# Altium schematic sheet DDR4 SDRAM.SchDoc
size A3
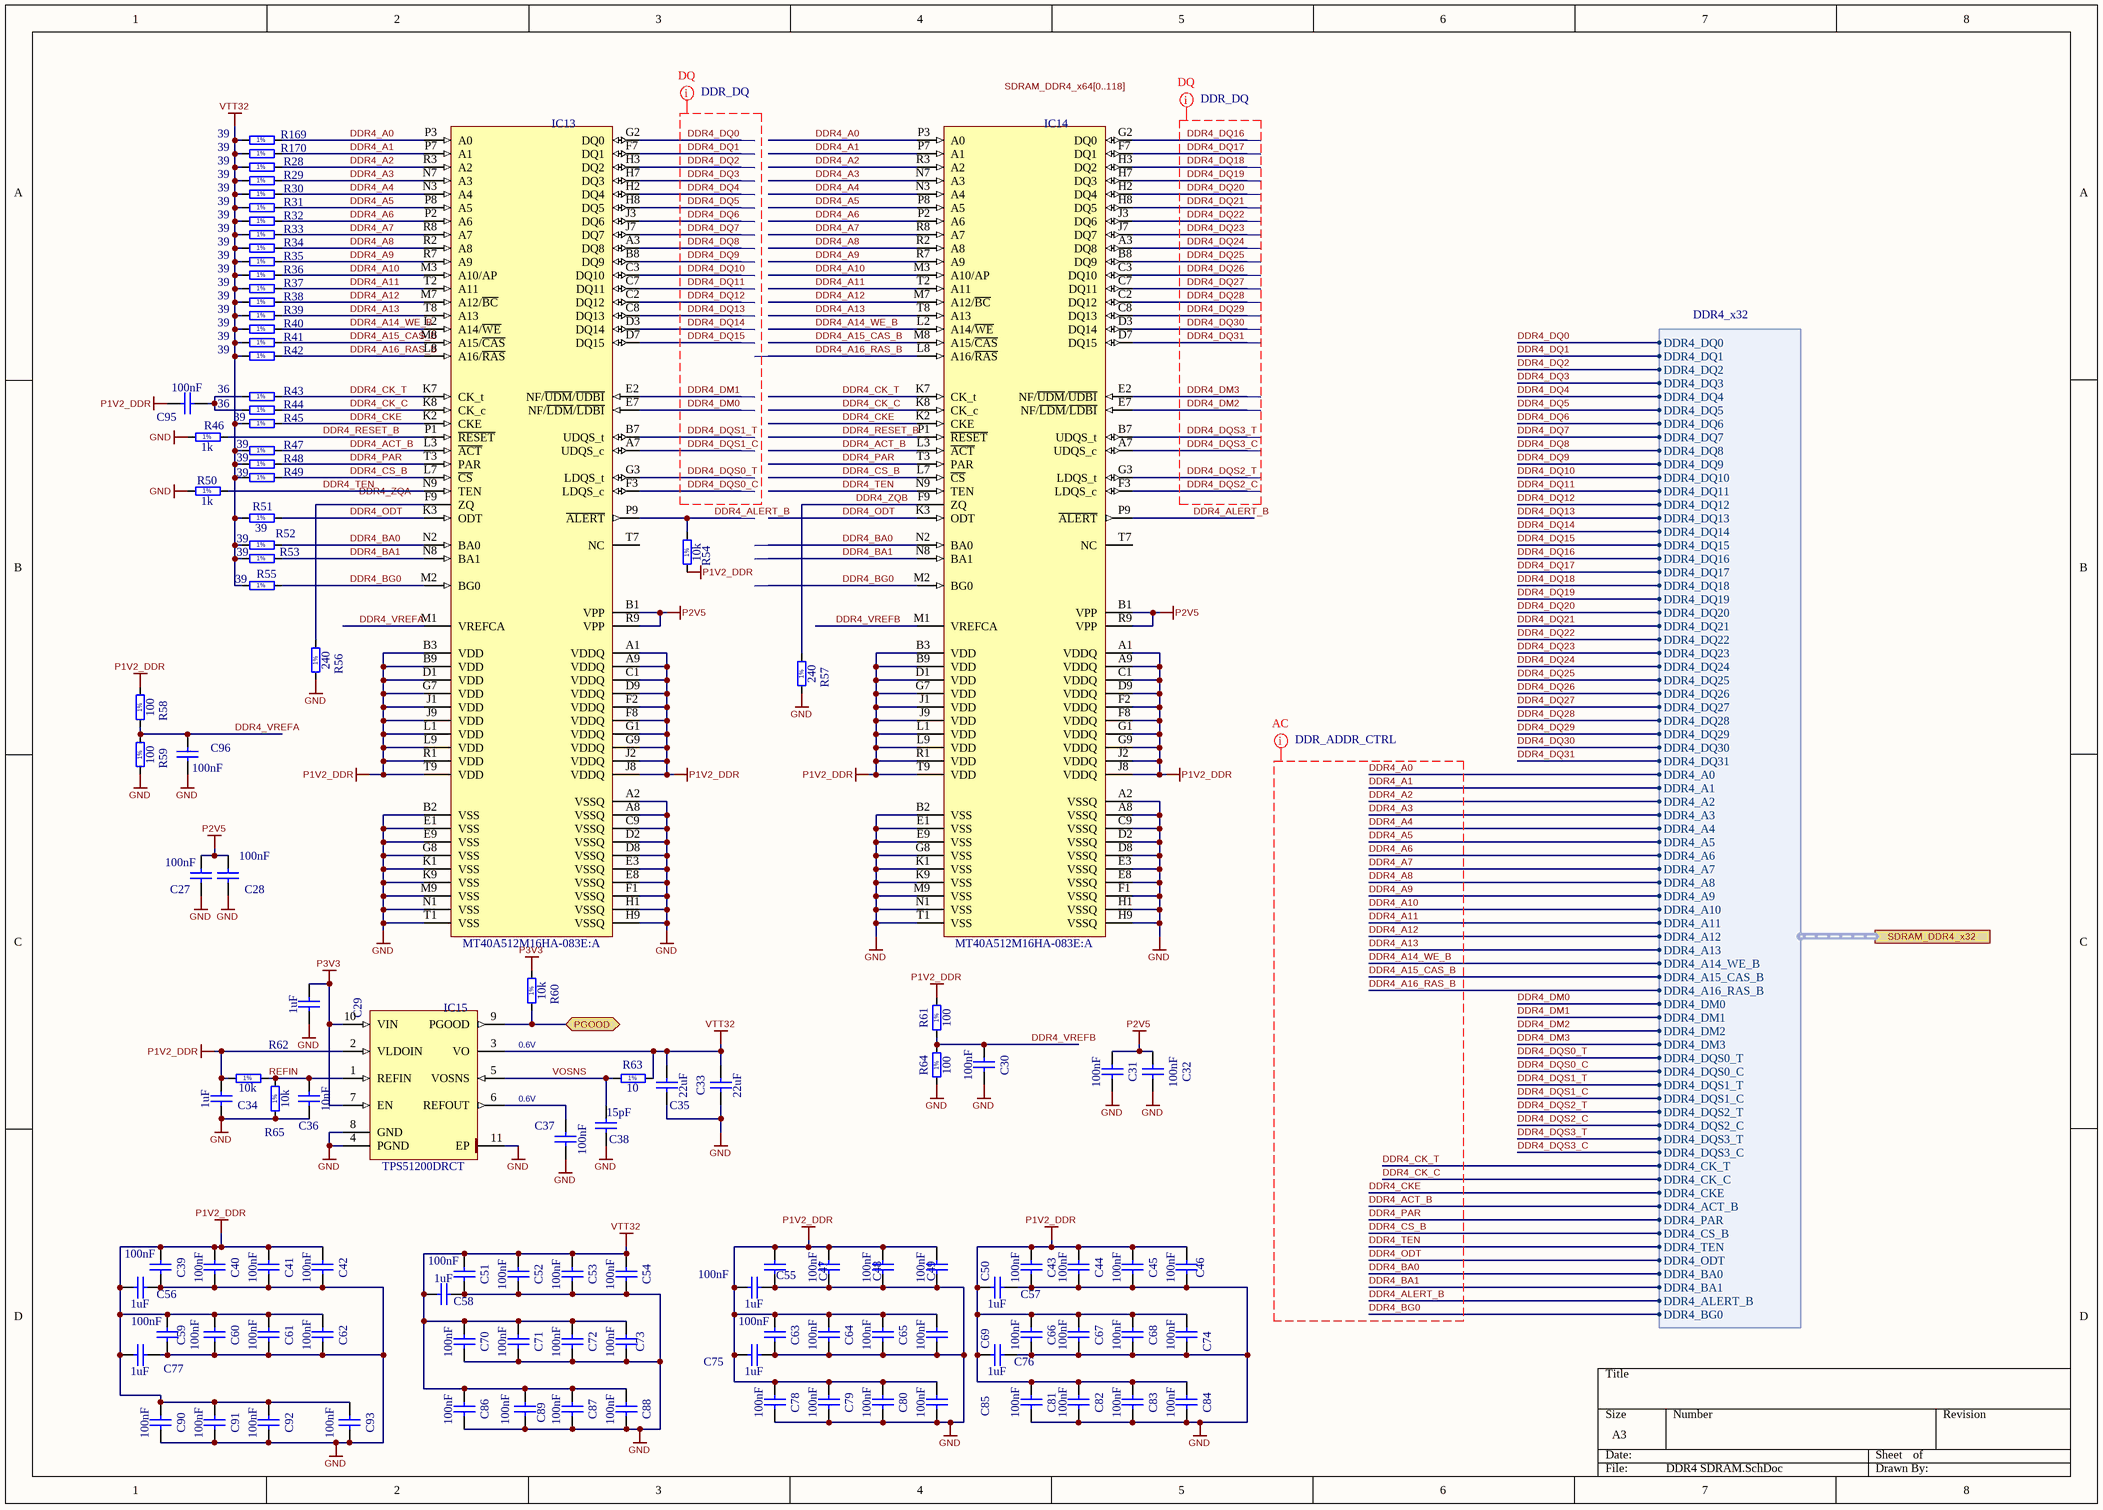
[diagram p0: DDR4 SDRAM.SchDoc]

## Parts
C27  100nF  [CAPC0603X33N]
C28  100nF  [CAPC0603X33N]
C29  1uF  [CAPC1005X55N]
C30  100nF  [CAPC0603X33N]
C31  100nF  [CAPC0603X33N]
C32  100nF  [CAPC0603X33N]
C33  22uF  [CAPC2012X135N]
C34  1uF  [CAPC1005X55N]
C35  22uF  [CAPC2012X135N]
C36  10nF  [CAPC1005X55N]
C37  100nF  [CAPC0603X33N]
C38  15pF  [CAPC1005X55N]
C39  100nF  [CAPC0603X33N]
C40  100nF  [CAPC0603X33N]
C41  100nF  [CAPC0603X33N]
C42  100nF  [CAPC0603X33N]
C43  100nF  [CAPC0603X33N]
C44  100nF  [CAPC0603X33N]
C45  100nF  [CAPC0603X33N]
C46  100nF  [CAPC0603X33N]
C47  100nF  [CAPC0603X33N]
C48  100nF  [CAPC0603X33N]
C49  100nF  [CAPC0603X33N]
C50  100nF  [CAPC0603X33N]
C51  100nF  [CAPC0603X33N]
C52  100nF  [CAPC0603X33N]
C53  100nF  [CAPC0603X33N]
C54  100nF  [CAPC0603X33N]
C55  1uF  [CAPC1005X55N]
C56  1uF  [CAPC1005X55N]
C57  1uF  [CAPC1005X55N]
C58  1uF  [CAPC1005X55N]
C59  100nF  [CAPC0603X33N]
C60  100nF  [CAPC0603X33N]
C61  100nF  [CAPC0603X33N]
C62  100nF  [CAPC0603X33N]
C63  100nF  [CAPC0603X33N]
C64  100nF  [CAPC0603X33N]
C65  100nF  [CAPC0603X33N]
C66  100nF  [CAPC0603X33N]
C67  100nF  [CAPC0603X33N]
C68  100nF  [CAPC0603X33N]
C69  100nF  [CAPC0603X33N]
C70  100nF  [CAPC0603X33N]
C71  100nF  [CAPC0603X33N]
C72  100nF  [CAPC0603X33N]
C73  100nF  [CAPC0603X33N]
C74  100nF  [CAPC0603X33N]
C75  1uF  [CAPC1005X55N]
C76  1uF  [CAPC1005X55N]
C77  1uF  [CAPC1005X55N]
C78  100nF  [CAPC0603X33N]
C79  100nF  [CAPC0603X33N]
C80  100nF  [CAPC0603X33N]
C81  100nF  [CAPC0603X33N]
C82  100nF  [CAPC0603X33N]
C83  100nF  [CAPC0603X33N]
C84  100nF  [CAPC0603X33N]
C85  100nF  [CAPC0603X33N]
C86  100nF  [CAPC0603X33N]
C87  100nF  [CAPC0603X33N]
C88  100nF  [CAPC0603X33N]
C89  100nF  [CAPC0603X33N]
C90  100nF  [CAPC0603X33N]
C91  100nF  [CAPC0603X33N]
C92  100nF  [CAPC0603X33N]
C93  100nF  [CAPC0603X33N]
C95  100nF  [CAPC0603X33N]
C96  100nF  [CAPC0603X33N]
IC13  MT40A512M16HA-083E:A  [BGA96C80P9X16_900X1400X120]
IC14  MT40A512M16HA-083E:A  [BGA96C80P9X16_900X1400X120]
IC15  TPS51200DRCT  [TEXAS_DRC (S-PVSON-N10)]
R28  39  [RESC1005X40N]
R29  39  [RESC1005X40N]
R30  39  [RESC1005X40N]
R31  39  [RESC1005X40N]
R32  39  [RESC1005X40N]
R33  39  [RESC1005X40N]
R34  39  [RESC1005X40N]
R35  39  [RESC1005X40N]
R36  39  [RESC1005X40N]
R37  39  [RESC1005X40N]
R38  39  [RESC1005X40N]
R39  39  [RESC1005X40N]
R40  39  [RESC1005X40N]
R41  39  [RESC1005X40N]
R42  39  [RESC1005X40N]
R43  36  [RESC1005X40N]
R44  36  [RESC1005X40N]
R45  39  [RESC1005X40N]
R46  1k  [RESC1005X40N]
R47  39  [RESC1005X40N]
R48  39  [RESC1005X40N]
R49  39  [RESC1005X40N]
R50  1k  [RESC1005X40N]
R51  39  [RESC1005X40N]
R52  39  [RESC1005X40N]
R53  39  [RESC1005X40N]
R54  10k  [RESC1005X40N]
R55  39  [RESC1005X40N]
R56  240  [RESC1005X40N]
R57  240  [RESC1005X40N]
R58  100  [RESC1005X40N]
R59  100  [RESC1005X40N]
R60  10k  [RESC1005X40N]
R61  100  [RESC1005X40N]
R62  10k  [RESC1005X40N]
R63  10  [RESC1005X40N]
R64  100  [RESC1005X40N]
R65  10k  [RESC1005X40N]
R169  39  [RESC1005X40N]
R170  39  [RESC1005X40N]

## Ports
PGOOD (bidir), SDRAM_DDR4_x32 (harness DDR4_x32)

## Harnesses
DDR4_x32: DDR4_DQ16, DDR4_DQ17, DDR4_DQ18, DDR4_DQ19, DDR4_DQ20, DDR4_DQ21, DDR4_DQ22, DDR4_DQ23, DDR4_DQ24, DDR4_DQ25, DDR4_DQ26, DDR4_DQ27, DDR4_DQ28, DDR4_DQ29, DDR4_DQ30, DDR4_DQ31, DDR4_A0, DDR4_A1, DDR4_A2, DDR4_A3, DDR4_A4, DDR4_A5, DDR4_A6, DDR4_A7, DDR4_A8, DDR4_A9, DDR4_A10, DDR4_A11, DDR4_A12, DDR4_A13, DDR4_A14_WE_B, DDR4_A15_CAS_B, DDR4_A16_RAS_B, DDR4_DM0, DDR4_DM1, DDR4_DM2, DDR4_DM3, DDR4_DQS0_T, DDR4_DQS0_C, DDR4_DQS1_T, DDR4_DQS1_C, DDR4_DQS2_T, DDR4_DQS2_C, DDR4_DQS3_T, DDR4_DQS3_C, DDR4_CK_T, DDR4_CK_C, DDR4_CKE, DDR4_ACT_B, DDR4_PAR, DDR4_CS_B, DDR4_TEN, DDR4_ODT, DDR4_BA0, DDR4_BA1, DDR4_ALERT_B, DDR4_BG0, DDR4_DQ0, DDR4_DQ1, DDR4_DQ2, DDR4_DQ3, DDR4_DQ4, DDR4_DQ5, DDR4_DQ6, DDR4_DQ7, DDR4_DQ8, DDR4_DQ9, DDR4_DQ10, DDR4_DQ11, DDR4_DQ12, DDR4_DQ13, DDR4_DQ14, DDR4_DQ15

## Nets
GND: C27.2 C28.2 C29.2 C30.2 C31.2 C32.2 C33.1 C34.2 C35.1 C36.1 C37.1 C38.1 C39.2 C40.2 C41.2 C42.2 C43.2 C44.2 C45.2 C46.2 C47.2 C48.2 C49.2 C50.2 C51.2 C52.2 C53.2 C54.2 C55.2 C56.2 C57.2 C58.2 C59.2 C60.2 C61.2 C62.2 C63.2 C64.2 C65.2 C66.2 C67.2 C68.2 C69.2 C70.2 C71.2 C72.2 C73.2 C74.2 C75.2 C76.2 C77.2 C78.2 C79.2 C80.2 C81.2 C82.2 C83.2 C84.2 C85.2 C86.2 C87.2 C88.2 C89.2 C90.2 C91.2 C92.2 C93.1 C96.2 IC13.A2(VSSQ) IC13.A8(VSSQ) IC13.B2(VSS) IC13.C9(VSSQ) IC13.D2(VSSQ) IC13.D8(VSSQ) IC13.E1(VSS) IC13.E3(VSSQ) IC13.E8(VSSQ) IC13.E9(VSS) IC13.F1(VSSQ) IC13.G8(VSS) IC13.H1(VSSQ) IC13.H9(VSSQ) IC13.K1(VSS) IC13.K9(VSS) IC13.M9(VSS) IC13.N1(VSS) IC13.T1(VSS) IC14.A2(VSSQ) IC14.A8(VSSQ) IC14.B2(VSS) IC14.C9(VSSQ) IC14.D2(VSSQ) IC14.D8(VSSQ) IC14.E1(VSS) IC14.E3(VSSQ) IC14.E8(VSSQ) IC14.E9(VSS) IC14.F1(VSSQ) IC14.G8(VSS) IC14.H1(VSSQ) IC14.H9(VSSQ) IC14.K1(VSS) IC14.K9(VSS) IC14.M9(VSS) IC14.N1(VSS) IC14.T1(VSS) IC15.4(PGND) IC15.8(GND) IC15.11(EP) R46.1 R50.1 R56.1 R57.1 R59.1 R64.1 R65.1
P1V2_DDR: C34.1 C39.1 C40.1 C41.1 C42.1 C43.1 C44.1 C45.1 C46.1 C47.1 C48.1 C49.1 C50.1 C55.1 C56.1 C57.1 C59.1 C60.1 C61.1 C62.1 C63.1 C64.1 C65.1 C66.1 C67.1 C68.1 C69.1 C74.1 C75.1 C76.1 C77.1 C78.1 C79.1 C80.1 C81.1 C82.1 C83.1 C84.1 C85.1 C90.1 C91.1 C92.1 C93.2 C95.2 IC13.A1(VDDQ) IC13.A9(VDDQ) IC13.B3(VDD) IC13.B9(VDD) IC13.C1(VDDQ) IC13.D1(VDD) IC13.D9(VDDQ) IC13.F2(VDDQ) IC13.F8(VDDQ) IC13.G1(VDDQ) IC13.G7(VDD) IC13.G9(VDDQ) IC13.J1(VDD) IC13.J2(VDDQ) IC13.J8(VDDQ) IC13.J9(VDD) IC13.L1(VDD) IC13.L9(VDD) IC13.R1(VDD) IC13.T9(VDD) IC14.A1(VDDQ) IC14.A9(VDDQ) IC14.B3(VDD) IC14.B9(VDD) IC14.C1(VDDQ) IC14.D1(VDD) IC14.D9(VDDQ) IC14.F2(VDDQ) IC14.F8(VDDQ) IC14.G1(VDDQ) IC14.G7(VDD) IC14.G9(VDDQ) IC14.J1(VDD) IC14.J2(VDDQ) IC14.J8(VDDQ) IC14.J9(VDD) IC14.L1(VDD) IC14.L9(VDD) IC14.R1(VDD) IC14.T9(VDD) IC15.2(VLDOIN) R54.1 R58.2 R61.2 R62.1
P2V5: C27.1 C28.1 C31.1 C32.1 IC13.B1(VPP) IC13.R9(VPP) IC14.B1(VPP) IC14.R9(VPP)
P3V3: C29.1 IC15.7(EN) IC15.10(VIN) R60.2
VTT32: C33.2 C35.2 C51.1 C52.1 C53.1 C54.1 C58.1 C70.1 C71.1 C72.1 C73.1 C86.1 C87.1 C88.1 C89.1 IC15.3(VO) R28.1 R29.1 R30.1 R31.1 R32.1 R33.1 R34.1 R35.1 R36.1 R37.1 R38.1 R39.1 R40.1 R41.1 R42.1 R45.1 R47.1 R48.1 R49.1 R51.1 R52.1 R53.1 R55.1 R63.2 R169.1 R170.1
DDR4_A0: IC13.P3(A0) IC14.P3(A0) R169.2 ; port SDRAM_DDR4_x32.DDR4_A0
DDR4_A1: IC13.P7(A1) IC14.P7(A1) R170.2 ; port SDRAM_DDR4_x32.DDR4_A1
DDR4_A2: IC13.R3(A2) IC14.R3(A2) R28.2 ; port SDRAM_DDR4_x32.DDR4_A2
DDR4_A3: IC13.N7(A3) IC14.N7(A3) R29.2 ; port SDRAM_DDR4_x32.DDR4_A3
DDR4_A4: IC13.N3(A4) IC14.N3(A4) R30.2 ; port SDRAM_DDR4_x32.DDR4_A4
DDR4_A5: IC13.P8(A5) IC14.P8(A5) R31.2 ; port SDRAM_DDR4_x32.DDR4_A5
DDR4_A6: IC13.P2(A6) IC14.P2(A6) R32.2 ; port SDRAM_DDR4_x32.DDR4_A6
DDR4_A7: IC13.R8(A7) IC14.R8(A7) R33.2 ; port SDRAM_DDR4_x32.DDR4_A7
DDR4_A8: IC13.R2(A8) IC14.R2(A8) R34.2 ; port SDRAM_DDR4_x32.DDR4_A8
DDR4_A9: IC13.R7(A9) IC14.R7(A9) R35.2 ; port SDRAM_DDR4_x32.DDR4_A9
DDR4_A10: IC13.M3(A10/AP) IC14.M3(A10/AP) R36.2 ; port SDRAM_DDR4_x32.DDR4_A10
DDR4_A11: IC13.T2(A11) IC14.T2(A11) R37.2 ; port SDRAM_DDR4_x32.DDR4_A11
DDR4_A12: IC13.M7(A12/~{BC}) IC14.M7(A12/~{BC}) R38.2 ; port SDRAM_DDR4_x32.DDR4_A12
DDR4_A13: IC13.T8(A13) IC14.T8(A13) R39.2 ; port SDRAM_DDR4_x32.DDR4_A13
DDR4_A14_WE_B: IC13.L2(A14/~{WE}) IC14.L2(A14/~{WE}) R40.2 ; port SDRAM_DDR4_x32.DDR4_A14_WE_B
DDR4_A15_CAS_B: IC13.M8(A15/~{CAS}) IC14.M8(A15/~{CAS}) R41.2 ; port SDRAM_DDR4_x32.DDR4_A15_CAS_B
DDR4_A16_RAS_B: IC13.L8(A16/~{RAS}) IC14.L8(A16/~{RAS}) R42.2 ; port SDRAM_DDR4_x32.DDR4_A16_RAS_B
DDR4_ACT_B: IC13.L3(~{ACT}) IC14.L3(~{ACT}) R47.2 ; port SDRAM_DDR4_x32.DDR4_ACT_B
DDR4_ALERT_B: IC13.P9(~{ALERT}) IC14.P9(~{ALERT}) R54.2 ; port SDRAM_DDR4_x32.DDR4_ALERT_B
DDR4_BA0: IC13.N2(BA0) IC14.N2(BA0) R52.2 ; port SDRAM_DDR4_x32.DDR4_BA0
DDR4_BA1: IC13.N8(BA1) IC14.N8(BA1) R53.2 ; port SDRAM_DDR4_x32.DDR4_BA1
DDR4_BG0: IC13.M2(BG0) IC14.M2(BG0) R55.2 ; port SDRAM_DDR4_x32.DDR4_BG0
DDR4_CK_C: IC13.K8(CK_c) IC14.K8(CK_c) R44.2 ; port SDRAM_DDR4_x32.DDR4_CK_C
DDR4_CK_T: IC13.K7(CK_t) IC14.K7(CK_t) R43.2 ; port SDRAM_DDR4_x32.DDR4_CK_T
DDR4_CKE: IC13.K2(CKE) IC14.K2(CKE) R45.2 ; port SDRAM_DDR4_x32.DDR4_CKE
DDR4_CS_B: IC13.L7(~{CS}) IC14.L7(~{CS}) R49.2 ; port SDRAM_DDR4_x32.DDR4_CS_B
DDR4_DM0: IC13.E7(NF/~{LDM}/~{LDBI}) ; port SDRAM_DDR4_x32.DDR4_DM0
DDR4_DM1: IC13.E2(NF/~{UDM}/~{UDBI}) ; port SDRAM_DDR4_x32.DDR4_DM1
DDR4_DM2: IC14.E7(NF/~{LDM}/~{LDBI}) ; port SDRAM_DDR4_x32.DDR4_DM2
DDR4_DM3: IC14.E2(NF/~{UDM}/~{UDBI}) ; port SDRAM_DDR4_x32.DDR4_DM3
DDR4_DQ0: IC13.G2(DQ0) ; port SDRAM_DDR4_x32.DDR4_DQ0
DDR4_DQ1: IC13.F7(DQ1) ; port SDRAM_DDR4_x32.DDR4_DQ1
DDR4_DQ2: IC13.H3(DQ2) ; port SDRAM_DDR4_x32.DDR4_DQ2
DDR4_DQ3: IC13.H7(DQ3) ; port SDRAM_DDR4_x32.DDR4_DQ3
DDR4_DQ4: IC13.H2(DQ4) ; port SDRAM_DDR4_x32.DDR4_DQ4
DDR4_DQ5: IC13.H8(DQ5) ; port SDRAM_DDR4_x32.DDR4_DQ5
DDR4_DQ6: IC13.J3(DQ6) ; port SDRAM_DDR4_x32.DDR4_DQ6
DDR4_DQ7: IC13.J7(DQ7) ; port SDRAM_DDR4_x32.DDR4_DQ7
DDR4_DQ8: IC13.A3(DQ8) ; port SDRAM_DDR4_x32.DDR4_DQ8
DDR4_DQ9: IC13.B8(DQ9) ; port SDRAM_DDR4_x32.DDR4_DQ9
DDR4_DQ10: IC13.C3(DQ10) ; port SDRAM_DDR4_x32.DDR4_DQ10
DDR4_DQ11: IC13.C7(DQ11) ; port SDRAM_DDR4_x32.DDR4_DQ11
DDR4_DQ12: IC13.C2(DQ12) ; port SDRAM_DDR4_x32.DDR4_DQ12
DDR4_DQ13: IC13.C8(DQ13) ; port SDRAM_DDR4_x32.DDR4_DQ13
DDR4_DQ14: IC13.D3(DQ14) ; port SDRAM_DDR4_x32.DDR4_DQ14
DDR4_DQ15: IC13.D7(DQ15) ; port SDRAM_DDR4_x32.DDR4_DQ15
DDR4_DQ16: IC14.G2(DQ0) ; port SDRAM_DDR4_x32.DDR4_DQ16
DDR4_DQ17: IC14.F7(DQ1) ; port SDRAM_DDR4_x32.DDR4_DQ17
DDR4_DQ18: IC14.H3(DQ2) ; port SDRAM_DDR4_x32.DDR4_DQ18
DDR4_DQ19: IC14.H7(DQ3) ; port SDRAM_DDR4_x32.DDR4_DQ19
DDR4_DQ20: IC14.H2(DQ4) ; port SDRAM_DDR4_x32.DDR4_DQ20
DDR4_DQ21: IC14.H8(DQ5) ; port SDRAM_DDR4_x32.DDR4_DQ21
DDR4_DQ22: IC14.J3(DQ6) ; port SDRAM_DDR4_x32.DDR4_DQ22
DDR4_DQ23: IC14.J7(DQ7) ; port SDRAM_DDR4_x32.DDR4_DQ23
DDR4_DQ24: IC14.A3(DQ8) ; port SDRAM_DDR4_x32.DDR4_DQ24
DDR4_DQ25: IC14.B8(DQ9) ; port SDRAM_DDR4_x32.DDR4_DQ25
DDR4_DQ26: IC14.C3(DQ10) ; port SDRAM_DDR4_x32.DDR4_DQ26
DDR4_DQ27: IC14.C7(DQ11) ; port SDRAM_DDR4_x32.DDR4_DQ27
DDR4_DQ28: IC14.C2(DQ12) ; port SDRAM_DDR4_x32.DDR4_DQ28
DDR4_DQ29: IC14.C8(DQ13) ; port SDRAM_DDR4_x32.DDR4_DQ29
DDR4_DQ30: IC14.D3(DQ14) ; port SDRAM_DDR4_x32.DDR4_DQ30
DDR4_DQ31: IC14.D7(DQ15) ; port SDRAM_DDR4_x32.DDR4_DQ31
DDR4_DQS0_C: IC13.F3(LDQS_c) ; port SDRAM_DDR4_x32.DDR4_DQS0_C
DDR4_DQS0_T: IC13.G3(LDQS_t) ; port SDRAM_DDR4_x32.DDR4_DQS0_T
DDR4_DQS1_C: IC13.A7(UDQS_c) ; port SDRAM_DDR4_x32.DDR4_DQS1_C
DDR4_DQS1_T: IC13.B7(UDQS_t) ; port SDRAM_DDR4_x32.DDR4_DQS1_T
DDR4_DQS2_C: IC14.F3(LDQS_c) ; port SDRAM_DDR4_x32.DDR4_DQS2_C
DDR4_DQS2_T: IC14.G3(LDQS_t) ; port SDRAM_DDR4_x32.DDR4_DQS2_T
DDR4_DQS3_C: IC14.A7(UDQS_c) ; port SDRAM_DDR4_x32.DDR4_DQS3_C
DDR4_DQS3_T: IC14.B7(UDQS_t) ; port SDRAM_DDR4_x32.DDR4_DQS3_T
DDR4_ODT: IC13.K3(ODT) IC14.K3(ODT) R51.2 ; port SDRAM_DDR4_x32.DDR4_ODT
DDR4_PAR: IC13.T3(PAR) IC14.T3(PAR) R48.2 ; port SDRAM_DDR4_x32.DDR4_PAR
DDR4_RESET_B: IC13.P1(~{RESET}) IC14.P1(~{RESET}) R46.2
DDR4_TEN: IC13.N9(TEN) IC14.N9(TEN) R50.2 ; port SDRAM_DDR4_x32.DDR4_TEN
DDR4_VREFA: C96.1 IC13.M1(VREFCA) R58.1 R59.2
DDR4_VREFB: C30.1 IC14.M1(VREFCA) R61.1 R64.2
DDR4_ZQB: IC14.F9(ZQ) R57.2
PGOOD: IC15.9(PGOOD) R60.1 ; port PGOOD
REFIN: C36.2 IC15.1(REFIN) R62.2 R65.2
VOSNS: C38.2 IC15.5(VOSNS) R63.1
NetC37_2: C37.2 IC15.6(REFOUT)
NetC95_1: C95.1 R43.1 R44.1
NetIC13_F9: IC13.F9(ZQ) R56.2

Not connected (* = marked no-connect by the designer): IC13 T7(NC); IC14 T7(NC)

## Buses and harness runs
bus SDRAM_DDR4_x64[0..118]

## Layout directives
net class DDR_DQ: DDR4_DM0, DDR4_DM1, DDR4_DM2, DDR4_DM3, DDR4_DQ0, DDR4_DQ1, DDR4_DQ2, DDR4_DQ3, DDR4_DQ4, DDR4_DQ5, DDR4_DQ6, DDR4_DQ7, DDR4_DQ8, DDR4_DQ9, DDR4_DQ10, DDR4_DQ11, DDR4_DQ12, DDR4_DQ13, DDR4_DQ14, DDR4_DQ15, DDR4_DQ16, DDR4_DQ17, DDR4_DQ18, DDR4_DQ19, DDR4_DQ20, DDR4_DQ21, DDR4_DQ22, DDR4_DQ23, DDR4_DQ24, DDR4_DQ25, DDR4_DQ26, DDR4_DQ27, DDR4_DQ28, DDR4_DQ29, DDR4_DQ30, DDR4_DQ31, DDR4_DQS0_C, DDR4_DQS0_T, DDR4_DQS1_C, DDR4_DQS1_T, DDR4_DQS2_C, DDR4_DQS2_T, DDR4_DQS3_C, DDR4_DQS3_T
net class DDR_ADDR_CTRL: DDR4_A0, DDR4_A1, DDR4_A2, DDR4_A3, DDR4_A4, DDR4_A5, DDR4_A6, DDR4_A7, DDR4_A8, DDR4_A9, DDR4_A10, DDR4_A11, DDR4_A12, DDR4_A13, DDR4_A14_WE_B, DDR4_A15_CAS_B, DDR4_A16_RAS_B, DDR4_ACT_B, DDR4_ALERT_B, DDR4_BA0, DDR4_BA1, DDR4_BG0, DDR4_CK_C, DDR4_CK_T, DDR4_CKE, DDR4_CS_B, DDR4_ODT, DDR4_PAR, DDR4_TEN

## Notes on the sheet
- 0.6V
- Labels drawn without touching a wire or pin: DDR4_ZQA, SDRAM_DDR4_x64[0..118]
- (in symbol R0402_1K_1%_0.0625W_100PPM) 1%
- (in symbol R0402_10K_1%_0.0625W_100PPM) 1%
- (in symbol R0402_10R_1%_0.0625W_200PPM) 1%
- (in symbol R0402_36R_1%_0.0625W_100PPM) 1%
- (in symbol R0402_39R_1%_0.0625W_100PPM) 1%
- (in symbol R0402_100R_1%_0.0625W_100PPM) 1%
- (in symbol R0402_240R_1%_0.0625W_100PPM) 1%

## Library data of the parts
C27 C28 C30-C32 C37 C39-C54 C59-C74 C78-C93 C95 C96 = CC0201_100NF_6.3V_10%_X5R: Non-polarised capacitor; Manufacturer: GENERIC; Part Description: SMD Multilayer Chip Ceramic Capacitor; Manufacturer1 Part Number: 02016D104KAT2A; Tolerance: ±10%; Voltage: 6.3V; TC: X5R; Manufacturer Part Number: CC0201_100NF_6.3V_10%_X5R; Part Number: CC0201_100NF_6.3V_10%_X5R; Value: 100nF; Component Kind: Standard; Component Type: Standard; Pin Count: 2; Status: Not Recommended; Case: 0201; Mounted: Yes; Socket: No; SMD: Yes; Sense: No; Manufacturer1 Example: AVX; Manufacturer1 ComponentHeight: 0.33mm; HelpURL: \\cern.ch\dfs\Applications\Altium\Datasheets\CC0201_X5R_AVX.pdf; Author: CERN DEM JLC; CreateDate: 03/12/2007; LatestRevisionDate: 03/12/2007
C29 C34 C55-C58 C75-C77 = CC0402_1UF_16V_10%_X5R: Non-polarised capacitor; Manufacturer: GENERIC; Part Description: SMD Multilayer Chip Ceramic Capacitor; Manufacturer1 Part Number: C1005X5R1C105KT; Tolerance: ±10%; Voltage: 16V; TC: X5R; Manufacturer Part Number: CC0402_1UF_16V_10%_X5R; Part Number: CC0402_1UF_16V_10%_X5R; Value: 1uF; Component Kind: Standard; Component Type: Standard; Pin Count: 2; Status: Preferred; Case: 0402; Mounted: Yes; Socket: No; SMD: Yes; Sense: No; Manufacturer1 Example: TDK; Manufacturer1 ComponentHeight: 0.55mm; HelpURL: \\cern.ch\dfs\Applications\Altium\Datasheets\CC0402_X5R_TDK_C.pdf; Author: CERN DEM JLC; CreateDate: 25/10/2012; LatestRevisionDate: 25/10/2012
C33 C35 = CC0805_22UF_10V_+80%-20%_Y5V: Non-polarised capacitor; Manufacturer: GENERIC; Part Description: SMD Multilayer Chip Ceramic Capacitor; Manufacturer1 Part Number: 2222 241 19881; Voltage: 10V; TC: Y5V; Manufacturer Part Number: CC0805_22UF_10V_+80%-20%_Y5V; Part Number: CC0805_22UF_10V_+80%-20%_Y5V; Tolerance: +80% -20%; Value: 22uF; Component Kind: Standard; Component Type: Standard; Pin Count: 2; Status: Preferred; Case: 0805; Mounted: Yes; Socket: No; SMD: Yes; Sense: No; Manufacturer1 Example: PHYCOMP; Manufacturer1 ComponentHeight: 1.45mm; HelpURL: \\cern.ch\dfs\Applications\Altium\Datasheets\CC0805_Y5V_PHYCOMP.pdf; Author: CERN DEM JLC; CreateDate: 03/12/2007; LatestRevisionDate: 03/12/2007
C36 = CC0402_10NF_25V_10%_X7R: Non-polarised capacitor; Manufacturer: GENERIC; Part Description: SMD Multilayer Chip Ceramic Capacitor; Manufacturer1 Part Number: C1005X7R1E103KT; Tolerance: ±10%; Voltage: 25V; TC: X7R; Manufacturer Part Number: CC0402_10NF_25V_10%_X7R; Part Number: CC0402_10NF_25V_10%_X7R; Value: 10nF; Component Kind: Standard; Component Type: Standard; Pin Count: 2; Status: Preferred; Case: 0402; Mounted: Yes; Socket: No; SMD: Yes; Sense: No; Manufacturer1 Example: TDK; Manufacturer1 ComponentHeight: 0.55mm; HelpURL: \\cern.ch\dfs\Applications\Altium\Datasheets\CC0402_X7R_TDK_C.pdf; Author: CERN DEM JLC; CreateDate: 25/10/2012; LatestRevisionDate: 25/10/2012
C38 = CC0402_15PF_50V_5%_C0G: Non-polarised capacitor; Manufacturer: GENERIC; Part Description: SMD Multilayer Chip Ceramic Capacitor; Manufacturer1 Part Number: C0402C150J5GACTU; Tolerance: ±5%; Voltage: 50V; TC: C0G/NP0; Manufacturer Part Number: CC0402_15PF_50V_5%_C0G; Part Number: CC0402_15PF_50V_5%_C0G; Value: 15pF; Component Kind: Standard; Component Type: Standard; Pin Count: 2; Status: Preferred; Case: 0402; Mounted: Yes; Socket: No; SMD: Yes; Sense: No; Manufacturer1 Example: KEMET; Manufacturer1 ComponentHeight: 0.55mm; HelpURL: \\cern.ch\dfs\Applications\Altium\Datasheets\CC0805_C0G_KEMET_(Commercial Grade).pdf; Author: CERN DEM JLC; CreateDate: 03/12/2007; LatestRevisionDate: 22/04/2015
IC13 IC14 = MT40A512M16HA-083E:A: +1.2V, 8Gb (512 Meg x 16 x 8 Banks) DDR4 SDRAM; Manufacturer: MICRON TECHNOLOGY; Part Description: +1.2V, 8Gb (512 Meg x 16) DDR4 SDRAM; PressFit: No; Bonding: No; Manufacturer Part Number: MT40A512M16HA-083E:A; PackageDescription: BGA 0.8mm, Pitch, Square 96 Pin, 9 Columns x 16 Rows, Body 14mm X 9mm X 1.2mm H; Part Number: MT40A512M16HA-083E:A; Component Kind: Standard; Component Type: Standard; Device: MT40A512M16HA-083E:A; Pin Count: 96; Case: BGA96; Mounted: Yes; Socket: No; SMD: Yes; Sense: No; ComponentHeight: 1.2mm; HelpURL: \\cern.ch\dfs\Applications\Altium\Datasheets\MT40A512M16HA-083E-A.pdf; Author: CERN DEM MR; CreateDate: 12/02/2016; LatestRevisionDate: 03/06/2016
IC15 = TPS51200DRCT: Sink/Source DDR Termination Regulator; Manufacturer: TEXAS INSTRUMENTS; Part Description: 3.3V Sink/Source DDR Termination Regulator; PressFit: No; Bonding: No; Manufacturer Part Number: TPS51200DRCT; PackageDescription: SON, 0.50mm Pitch, 10-pin, 3.00mm W  X 3.00mm L X 1.00mm Height, (w/thermal tab 1.75 X 2.50 mm); Part Number: TPS51200DRCT; Component Kind: Standard; Component Type: Standard; Device: TPS51200DRCT; Pin Count: 11; Case: SON10; Mounted: Yes; Socket: No; SMD: Yes; Sense: No; ComponentHeight: 1mm; HelpURL: \\cern.ch\dfs\Applications\Altium\Datasheets\TPS51200DRCT.pdf; Author: CERN DEM JLC; CreateDate: 03/02/2010; LatestRevisionDate: 06/11/2013
R28-R42 R45 R47-R49 R51-R53 R55 R169 R170 = R0402_39R_1%_0.0625W_100PPM: Resistor - 1%; Manufacturer: GENERIC; Part Description: General Purpose Thick Film Chip Resistor; Manufacturer1 Part Number: 232270673909L; TC: ±100ppm/°C; PressFit: No; Manufacturer Part Number: R0402_39R_1%_0.0625W_100PPM; Part Number: R0402_39R_1%_0.0625W_100PPM; Tolerance: ±1%; Value: 39; Component Kind: Standard; Component Type: Standard; Pin Count: 2; Status: Not Recommended; Power: 0.0625W; Case: 0402; Mounted: Yes; Sense: No; Socket: No; SMD: Yes; Manufacturer1 Example: YAGEO PHYCOMP; Manufacturer1 ComponentHeight: 0.4mm; HelpURL: \\cern.ch\dfs\Applications\Altium\Datasheets\R0402_Phycomp_RC0402.pdf; Author: CERN DEM JLC; CreateDate: 03/12/2007; LatestRevisionDate: 17/10/2012
R43 R44 = R0402_36R_1%_0.0625W_100PPM: Resistor - 1%; Manufacturer: GENERIC; Part Description: General Purpose Thick Film Chip Resistor; Manufacturer1 Part Number: 232270673609L; TC: ±100ppm/°C; PressFit: No; Manufacturer Part Number: R0402_36R_1%_0.0625W_100PPM; Part Number: R0402_36R_1%_0.0625W_100PPM; Tolerance: ±1%; Value: 36; Component Kind: Standard; Component Type: Standard; Pin Count: 2; Status: Not Recommended; Power: 0.0625W; Case: 0402; Mounted: Yes; Sense: No; Socket: No; SMD: Yes; Manufacturer1 Example: YAGEO PHYCOMP; Manufacturer1 ComponentHeight: 0.4mm; HelpURL: \\cern.ch\dfs\Applications\Altium\Datasheets\R0402_Phycomp_RC0402.pdf; Author: CERN DEM JLC; CreateDate: 03/12/2007; LatestRevisionDate: 17/10/2012
R46 R50 = R0402_1K_1%_0.0625W_100PPM: Resistor - 1%; Manufacturer: GENERIC; Part Description: General Purpose Thick Film Chip Resistor; Manufacturer1 Part Number: 232270671002L; TC: ±100ppm/°C; PressFit: No; Manufacturer Part Number: R0402_1K_1%_0.0625W_100PPM; Part Number: R0402_1K_1%_0.0625W_100PPM; Tolerance: ±1%; Value: 1k; Component Kind: Standard; Component Type: Standard; Pin Count: 2; Status: Not Recommended; Power: 0.0625W; Case: 0402; Mounted: Yes; Sense: No; Socket: No; SMD: Yes; Manufacturer1 Example: YAGEO PHYCOMP; Manufacturer1 ComponentHeight: 0.4mm; HelpURL: \\cern.ch\dfs\Applications\Altium\Datasheets\R0402_Phycomp_RC0402.pdf; Author: CERN DEM JLC; CreateDate: 03/12/2007; LatestRevisionDate: 17/10/2012
R54 R60 R62 R65 = R0402_10K_1%_0.0625W_100PPM: Resistor - 1%; Manufacturer: GENERIC; Part Description: General Purpose Thick Film Chip Resistor; Manufacturer1 Part Number: 232270671003L; TC: ±100ppm/°C; PressFit: No; Manufacturer Part Number: R0402_10K_1%_0.0625W_100PPM; Part Number: R0402_10K_1%_0.0625W_100PPM; Tolerance: ±1%; Value: 10k; Component Kind: Standard; Component Type: Standard; Pin Count: 2; Status: Not Recommended; Power: 0.0625W; Case: 0402; Mounted: Yes; Sense: No; Socket: No; SMD: Yes; Manufacturer1 Example: YAGEO PHYCOMP; Manufacturer1 ComponentHeight: 0.4mm; HelpURL: \\cern.ch\dfs\Applications\Altium\Datasheets\R0402_Phycomp_RC0402.pdf; Author: CERN DEM JLC; CreateDate: 03/12/2007; LatestRevisionDate: 17/10/2012
R56 R57 = R0402_240R_1%_0.0625W_100PPM: Resistor - 1%; Manufacturer: GENERIC; Part Description: General Purpose Thick Film Chip Resistor; Manufacturer1 Part Number: 232270672401L; TC: ±100ppm/°C; PressFit: No; Manufacturer Part Number: R0402_240R_1%_0.0625W_100PPM; Part Number: R0402_240R_1%_0.0625W_100PPM; Tolerance: ±1%; Value: 240; Component Kind: Standard; Component Type: Standard; Pin Count: 2; Status: Not Recommended; Power: 0.0625W; Case: 0402; Mounted: Yes; Sense: No; Socket: No; SMD: Yes; Manufacturer1 Example: YAGEO PHYCOMP; Manufacturer1 ComponentHeight: 0.4mm; HelpURL: \\cern.ch\dfs\Applications\Altium\Datasheets\R0402_Phycomp_RC0402.pdf; Author: CERN DEM JLC; CreateDate: 03/12/2007; LatestRevisionDate: 17/10/2012
R58 R59 R61 R64 = R0402_100R_1%_0.0625W_100PPM: Resistor - 1%; Manufacturer: GENERIC; Part Description: General Purpose Thick Film Chip Resistor; Manufacturer1 Part Number: 232270671001L; TC: ±100ppm/°C; PressFit: No; Manufacturer Part Number: R0402_100R_1%_0.0625W_100PPM; Part Number: R0402_100R_1%_0.0625W_100PPM; Tolerance: ±1%; Value: 100; Component Kind: Standard; Component Type: Standard; Pin Count: 2; Status: Not Recommended; Power: 0.0625W; Case: 0402; Mounted: Yes; Sense: No; Socket: No; SMD: Yes; Manufacturer1 Example: YAGEO PHYCOMP; Manufacturer1 ComponentHeight: 0.4mm; HelpURL: \\cern.ch\dfs\Applications\Altium\Datasheets\R0402_Phycomp_RC0402.pdf; Author: CERN DEM JLC; CreateDate: 03/12/2007; LatestRevisionDate: 17/10/2012
R63 = R0402_10R_1%_0.0625W_200PPM: Resistor - 1%; Manufacturer: GENERIC; Part Description: General Purpose Thick Film Chip Resistor; Manufacturer1 Part Number: 232270671009L; TC: ±200ppm/°C; PressFit: No; Manufacturer Part Number: R0402_10R_1%_0.0625W_200PPM; Part Number: R0402_10R_1%_0.0625W_200PPM; Tolerance: ±1%; Value: 10; Component Kind: Standard; Component Type: Standard; Pin Count: 2; Status: Not Recommended; Power: 0.0625W; Case: 0402; Mounted: Yes; Sense: No; Socket: No; SMD: Yes; Manufacturer1 Example: YAGEO PHYCOMP; Manufacturer1 ComponentHeight: 0.4mm; HelpURL: \\cern.ch\dfs\Applications\Altium\Datasheets\R0402_Phycomp_RC0402.pdf; Author: CERN DEM JLC; CreateDate: 24/06/2009; LatestRevisionDate: 17/10/2012